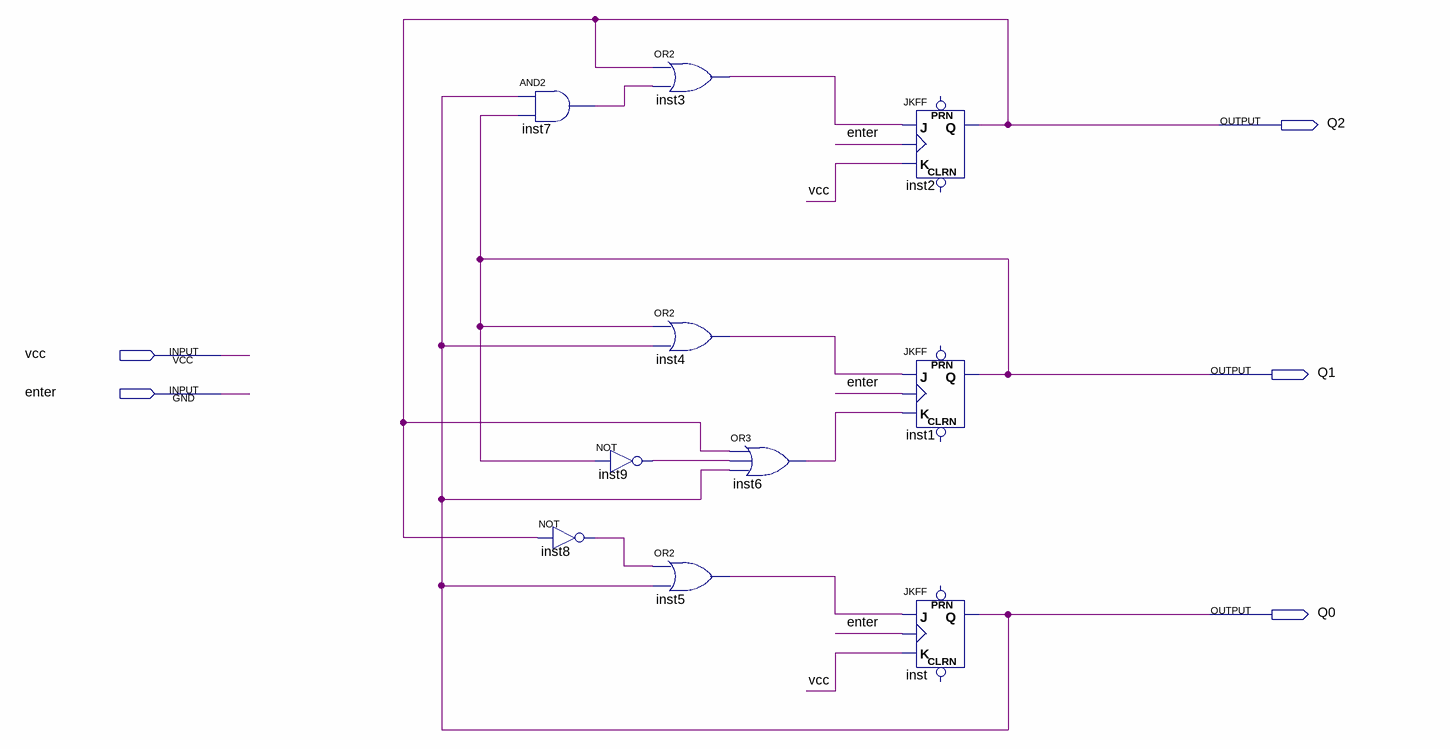
[diagram p0: schematic sheet]
// Quartus schematic Contador_de_0_a_5.bdf as structural Verilog: 10 symbols, 5 pins
module Contador_de_0_a_5 (
  input  vcc,
  input  enter,
  output Q2,
  output Q1,
  output Q0
);

  wire inst3_out, inst4_out, inst5_out, inst6_out, inst7_out, inst8_out, inst9_out;

  and inst7 (inst7_out, Q0, Q1);
  not inst8 (inst8_out, Q2);
  or inst3 (inst3_out, Q2, inst7_out);
  or inst4 (inst4_out, Q1, Q0);
  not inst9 (inst9_out, Q1);
  or inst5 (inst5_out, inst8_out, Q0);
  or inst6 (inst6_out, Q2, inst9_out, Q0);
  JKFF inst2 (.K(vcc), .J(inst3_out), .CLK(enter), .Q(Q2));  // open: PRN, CLRN
  JKFF inst1 (.K(inst6_out), .J(inst4_out), .CLK(enter), .Q(Q1));  // open: PRN, CLRN
  JKFF inst (.K(vcc), .J(inst5_out), .CLK(enter), .Q(Q0));  // open: PRN, CLRN
endmodule
